# Altium project WarShip_ExtraBoard.PrjPcb
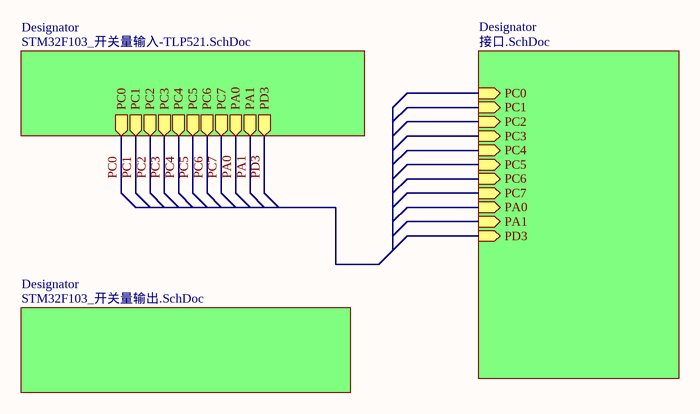
[diagram p0: STM32F103_扩展板.SchDoc]
4 sheets, 142 parts. Net scope: global (net labels, ports and power ports of the same name join across sheets).
Board file: STM32F103_扩展板.PcbDoc
Sheets:
  STM32F103_扩展板.SchDoc
    Designator = STM32F103_开关量输入-TLP521.SchDoc
    Designator = STM32F103_开关量输出.SchDoc
    Designator = 接口.SchDoc

## Sheet STM32F103_扩展板.SchDoc
size A4; SheetNumber: 1; SheetTotal: 4

### Sub-sheets
Designator = STM32F103_开关量输入-TLP521.SchDoc: PC0 (out), PC1 (out), PC2 (out), PC3 (out), PC4 (out), PC5 (out), PC6 (out), PC7 (out), PA0 (out), PA1 (out), PD3 (out)
Designator = STM32F103_开关量输出.SchDoc: no entries
Designator = 接口.SchDoc: PC0 (in), PC1 (in), PC2 (in), PC3 (in), PC4 (in), PC5 (in), PC6 (in), PC7 (in), PA0 (in), PA1 (in), PD3 (in)

## Sheet STM32F103_开关量输入-TLP521.SchDoc
size A4; SheetNumber: 4; SheetTotal: 4
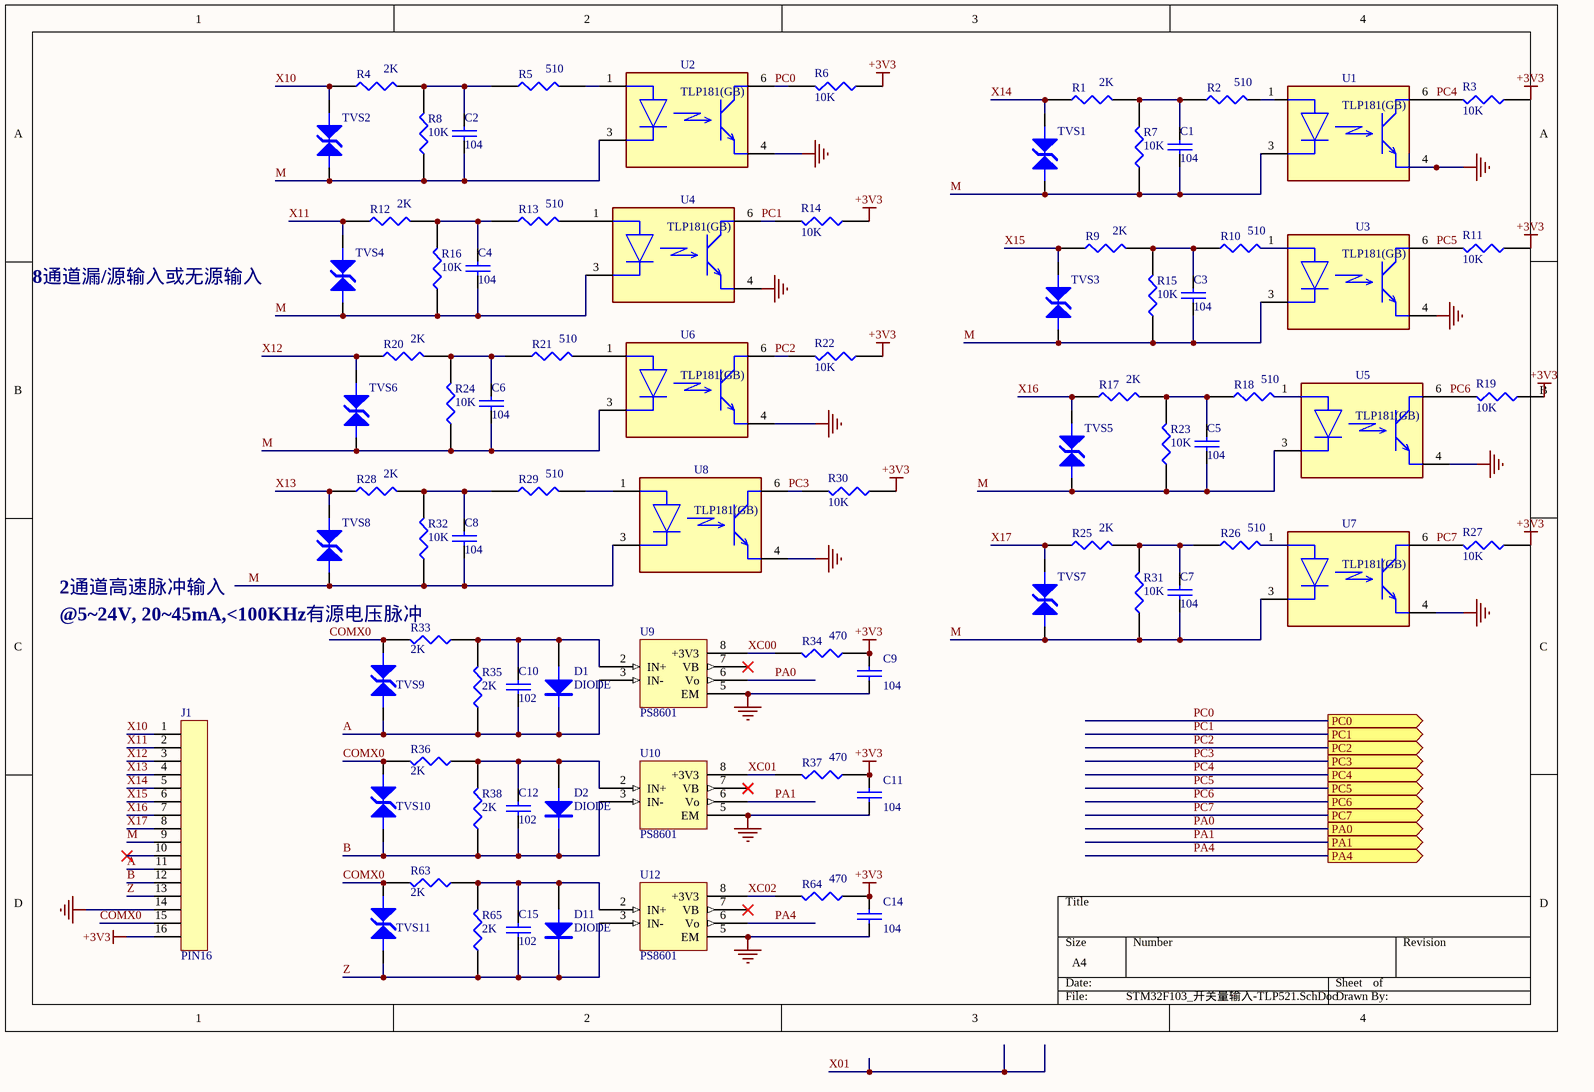
[diagram p1: STM32F103_开关量输入-TLP521.SchDoc]

### Parts
C1  104  [CAP[0603]]
C2  104  [CAP[0603]]
C3  104  [CAP[0603]]
C4  104  [CAP[0603]]
C5  104  [CAP[0603]]
C6  104  [CAP[0603]]
C7  104  [CAP[0603]]
C8  104  [CAP[0603]]
C9  104  [CAP[0603]]
C10  102  [CAP[0603]]
C11  104  [CAP[0603]]
C12  102  [CAP[0603]]
C14  104  [CAP[0603]]
C15  102  [CAP[0603]]
D1  DIODE  [SOD-123]
D2  DIODE  [SOD-123]
D11  DIODE  [SOD-123]
J1  PIN16  [KF128-5.08-16P]
R1  2K  [RES[0603]]
R2  510  [RES[0603]]
R3  10K  [RES[0603]]
R4  2K  [RES[0603]]
R5  510  [RES[0603]]
R6  10K  [RES[0603]]
R7  10K  [RES[0603]]
R8  10K  [RES[0603]]
R9  2K  [RES[0603]]
R10  510  [RES[0603]]
R11  10K  [RES[0603]]
R12  2K  [RES[0603]]
R13  510  [RES[0603]]
R14  10K  [RES[0603]]
R15  10K  [RES[0603]]
R16  10K  [RES[0603]]
R17  2K  [RES[0603]]
R18  510  [RES[0603]]
R19  10K  [RES[0603]]
R20  2K  [RES[0603]]
R21  510  [RES[0603]]
R22  10K  [RES[0603]]
R23  10K  [RES[0603]]
R24  10K  [RES[0603]]
R25  2K  [RES[0603]]
R26  510  [RES[0603]]
R27  10K  [RES[0603]]
R28  2K  [RES[0603]]
R29  510  [RES[0603]]
R30  10K  [RES[0603]]
R31  10K  [RES[0603]]
R32  10K  [RES[0603]]
R33  2K  [RES[0603]]
R34  470  [RES[0603]]
R35  2K  [RES[0603]]
R36  2K  [RES[0603]]
R37  470  [RES[0603]]
R38  2K  [RES[0603]]
R63  2K  [RES[0603]]
R64  470  [RES[0603]]
R65  2K  [RES[0603]]
TVS1  (no value)  [TVS]
TVS2  (no value)  [TVS]
TVS3  (no value)  [TVS]
TVS4  (no value)  [TVS]
TVS5  (no value)  [TVS]
TVS6  (no value)  [TVS]
TVS7  (no value)  [TVS]
TVS8  (no value)  [TVS]
TVS9  (no value)  [TVS]
TVS10  (no value)  [TVS]
TVS11  (no value)  [TVS]
U1  TLP181(GB)  [FP-11-4C1-MFG]
U2  TLP181(GB)  [FP-11-4C1-MFG]
U3  TLP181(GB)  [FP-11-4C1-MFG]
U4  TLP181(GB)  [FP-11-4C1-MFG]
U5  TLP181(GB)  [FP-11-4C1-MFG]
U6  TLP181(GB)  [FP-11-4C1-MFG]
U7  TLP181(GB)  [FP-11-4C1-MFG]
U8  TLP181(GB)  [FP-11-4C1-MFG]
U9  PS8601  [DIP8_8601]
U10  PS8601  [DIP8_8601]
U12  PS8601  [DIP8_8601]

### Ports
PA0 (out), PA1 (out), PA4 (out), PC0 (out), PC1 (out), PC2 (out), PC3 (out), PC4 (out), PC5 (out), PC6 (out), PC7 (out)

### Nets
+3V3: C9.1 C11.1 C14.1 J1.16 R3.1 R6.1 R11.1 R14.1 R19.1 R22.1 R27.1 R30.1 R34.1 R37.1 R64.1
GND: C9.2 C11.2 C14.2 J1.14 U1.4(E) U2.4(E) U3.4(E) U4.4(E) U5.4(E) U6.4(E) U7.4(E) U8.4(E) U9.5(EM) U10.5(EM) U12.5(EM)
NC: U9.1(NC) U9.4(NC) U10.1(NC) U10.4(NC) U12.1(NC) U12.4(NC)
A: C10.2 D1.2(K) J1.11 R35.1 TVS9.1(A) U9.3(IN-)
B: C12.2 D2.2(K) J1.12 R38.1 TVS10.1(A) U10.3(IN-)
COMX0: J1.15 R33.2 R36.2 R63.2 TVS9.2(K) TVS10.2(K) TVS11.2(K)
M: C1.2 C2.2 C3.2 C4.2 C5.2 C6.2 C7.2 C8.2 J1.9 R7.1 R8.1 R15.1 R16.1 R23.1 R24.1 R31.1 R32.1 TVS1.1(A) TVS2.1(A) TVS3.1(A) TVS4.1(A) TVS5.1(A) TVS6.1(A) TVS7.1(A) TVS8.1(A) U1.3(C) U2.3(C) U3.3(C) U4.3(C) U5.3(C) U6.3(C) U7.3(C) U8.3(C)
PA0: U9.6(Vo) ; port PA0
PA1: U10.6(Vo) ; port PA1
PA4: U12.6(Vo) ; port PA4
PC0: R6.2 U2.6(C) ; port PC0
PC1: R14.2 U4.6(C) ; port PC1
PC2: R22.2 U6.6(C) ; port PC2
PC3: R30.2 U8.6(C) ; port PC3
PC4: R3.2 U1.6(C) ; port PC4
PC5: R11.2 U3.6(C) ; port PC5
PC6: R19.2 U5.6(C) ; port PC6
PC7: R27.2 U7.6(C) ; port PC7
X10: J1.1 R4.1 TVS2.2(K)
X11: J1.2 R12.1 TVS4.2(K)
X12: J1.3 R20.1 TVS6.2(K)
X13: J1.4 R28.1 TVS8.2(K)
X14: J1.5 R1.1 TVS1.2(K)
X15: J1.6 R9.1 TVS3.2(K)
X16: J1.7 R17.1 TVS5.2(K)
X17: J1.8 R25.1 TVS7.2(K)
XC00: R34.2 U9.8(+3V3)
XC01: R37.2 U10.8(+3V3)
XC02: R64.2 U12.8(+3V3)
Z: C15.2 D11.2(K) J1.13 R65.1 TVS11.1(A) U12.3(IN-)
NetC1_1: C1.1 R1.2 R2.1 R7.2
NetC2_1: C2.1 R4.2 R5.1 R8.2
NetC3_1: C3.1 R9.2 R10.1 R15.2
NetC4_1: C4.1 R12.2 R13.1 R16.2
NetC5_1: C5.1 R17.2 R18.1 R23.2
NetC6_1: C6.1 R20.2 R21.1 R24.2
NetC7_1: C7.1 R25.2 R26.1 R31.2
NetC8_1: C8.1 R28.2 R29.1 R32.2
NetC10_1: C10.1 D1.1(A) R33.1 R35.2 U9.2(IN+)
NetC12_1: C12.1 D2.1(A) R36.1 R38.2 U10.2(IN+)
NetC15_1: C15.1 D11.1(A) R63.1 R65.2 U12.2(IN+)
NetR2_2: R2.2 U1.1(A)
NetR5_2: R5.2 U2.1(A)
NetR10_2: R10.2 U3.1(A)
NetR13_2: R13.2 U4.1(A)
NetR18_2: R18.2 U5.1(A)
NetR21_2: R21.2 U6.1(A)
NetR26_2: R26.2 U7.1(A)
NetR29_2: R29.2 U8.1(A)

Not connected (* = marked no-connect by the designer): J1 10*; U9 7(VB)*; U10 7(VB)*; U12 7(VB)*

### Notes on the sheet
- 8通道漏/源输入或无源输入
- 2通道高速脉冲输入
- @5~24V, 20~45mA,<100KHz有源电压脉冲

### Library data of the parts
C1-C12 C14 C15 = CAP: Capacitor
R1-R38 R63-R65 = RES1
TVS1-TVS11 = TVS
U1-U8 = CMP-35887-000008-1: OPTOCOUPLER TRANS 3.75KVRMS 6SO; Manufacturer: Toshiba; Collector Emitter Voltage: 80V; Min Current Transfer Ratio: 100%; Max Junction Temp: +125°C; Power Dissipation: 200mW; Max Current Transfer Ratio: 600%; Max Supply Voltage: 48V; Forward Voltage: 1.15V; Turn On Delay Time: 3us; Isolation Voltage: 3750Vrms; Reverse Voltage: 5V; Forward Current: 10mA; Emiiter Collector Voltage: 7V; Standoff Height: 0.1mm; Footprint Url: https://toshiba.semicon-storage.com/eu/design-support/package/detail.4pin%20MFSOP6.html; Device Class L3: unset; ComponentLink2Description: Datasheet; Device Class L1: Optoelectronics; Temperature: -55°C to +110°C; Temperature Range High: +110°C; Automotive: No; Octopart: https://octopart.com/tlp181gb-toshiba-8180795; ComponentLink2URL: https://toshiba.semicon-storage.com/info/docget.jsp?did=16749&prodName=TLP181; Category: Trans; Package: 11-4C1; Turn Off Delay Time: 3us; Temperature Range Low: -55°C; Device Class L2: Optocouplers; RoHS: TRUE; Lead Free: Yes; Ipc Land Pattern Name: SOP254P700X260-4; Manufacturer Part Number: TLP181(GB); Height: 2.8mm
U9 U10 U12 = PS8601: High speed optocoupler

## Sheet STM32F103_开关量输出.SchDoc
size A2; SheetNumber: 2; SheetTotal: 4
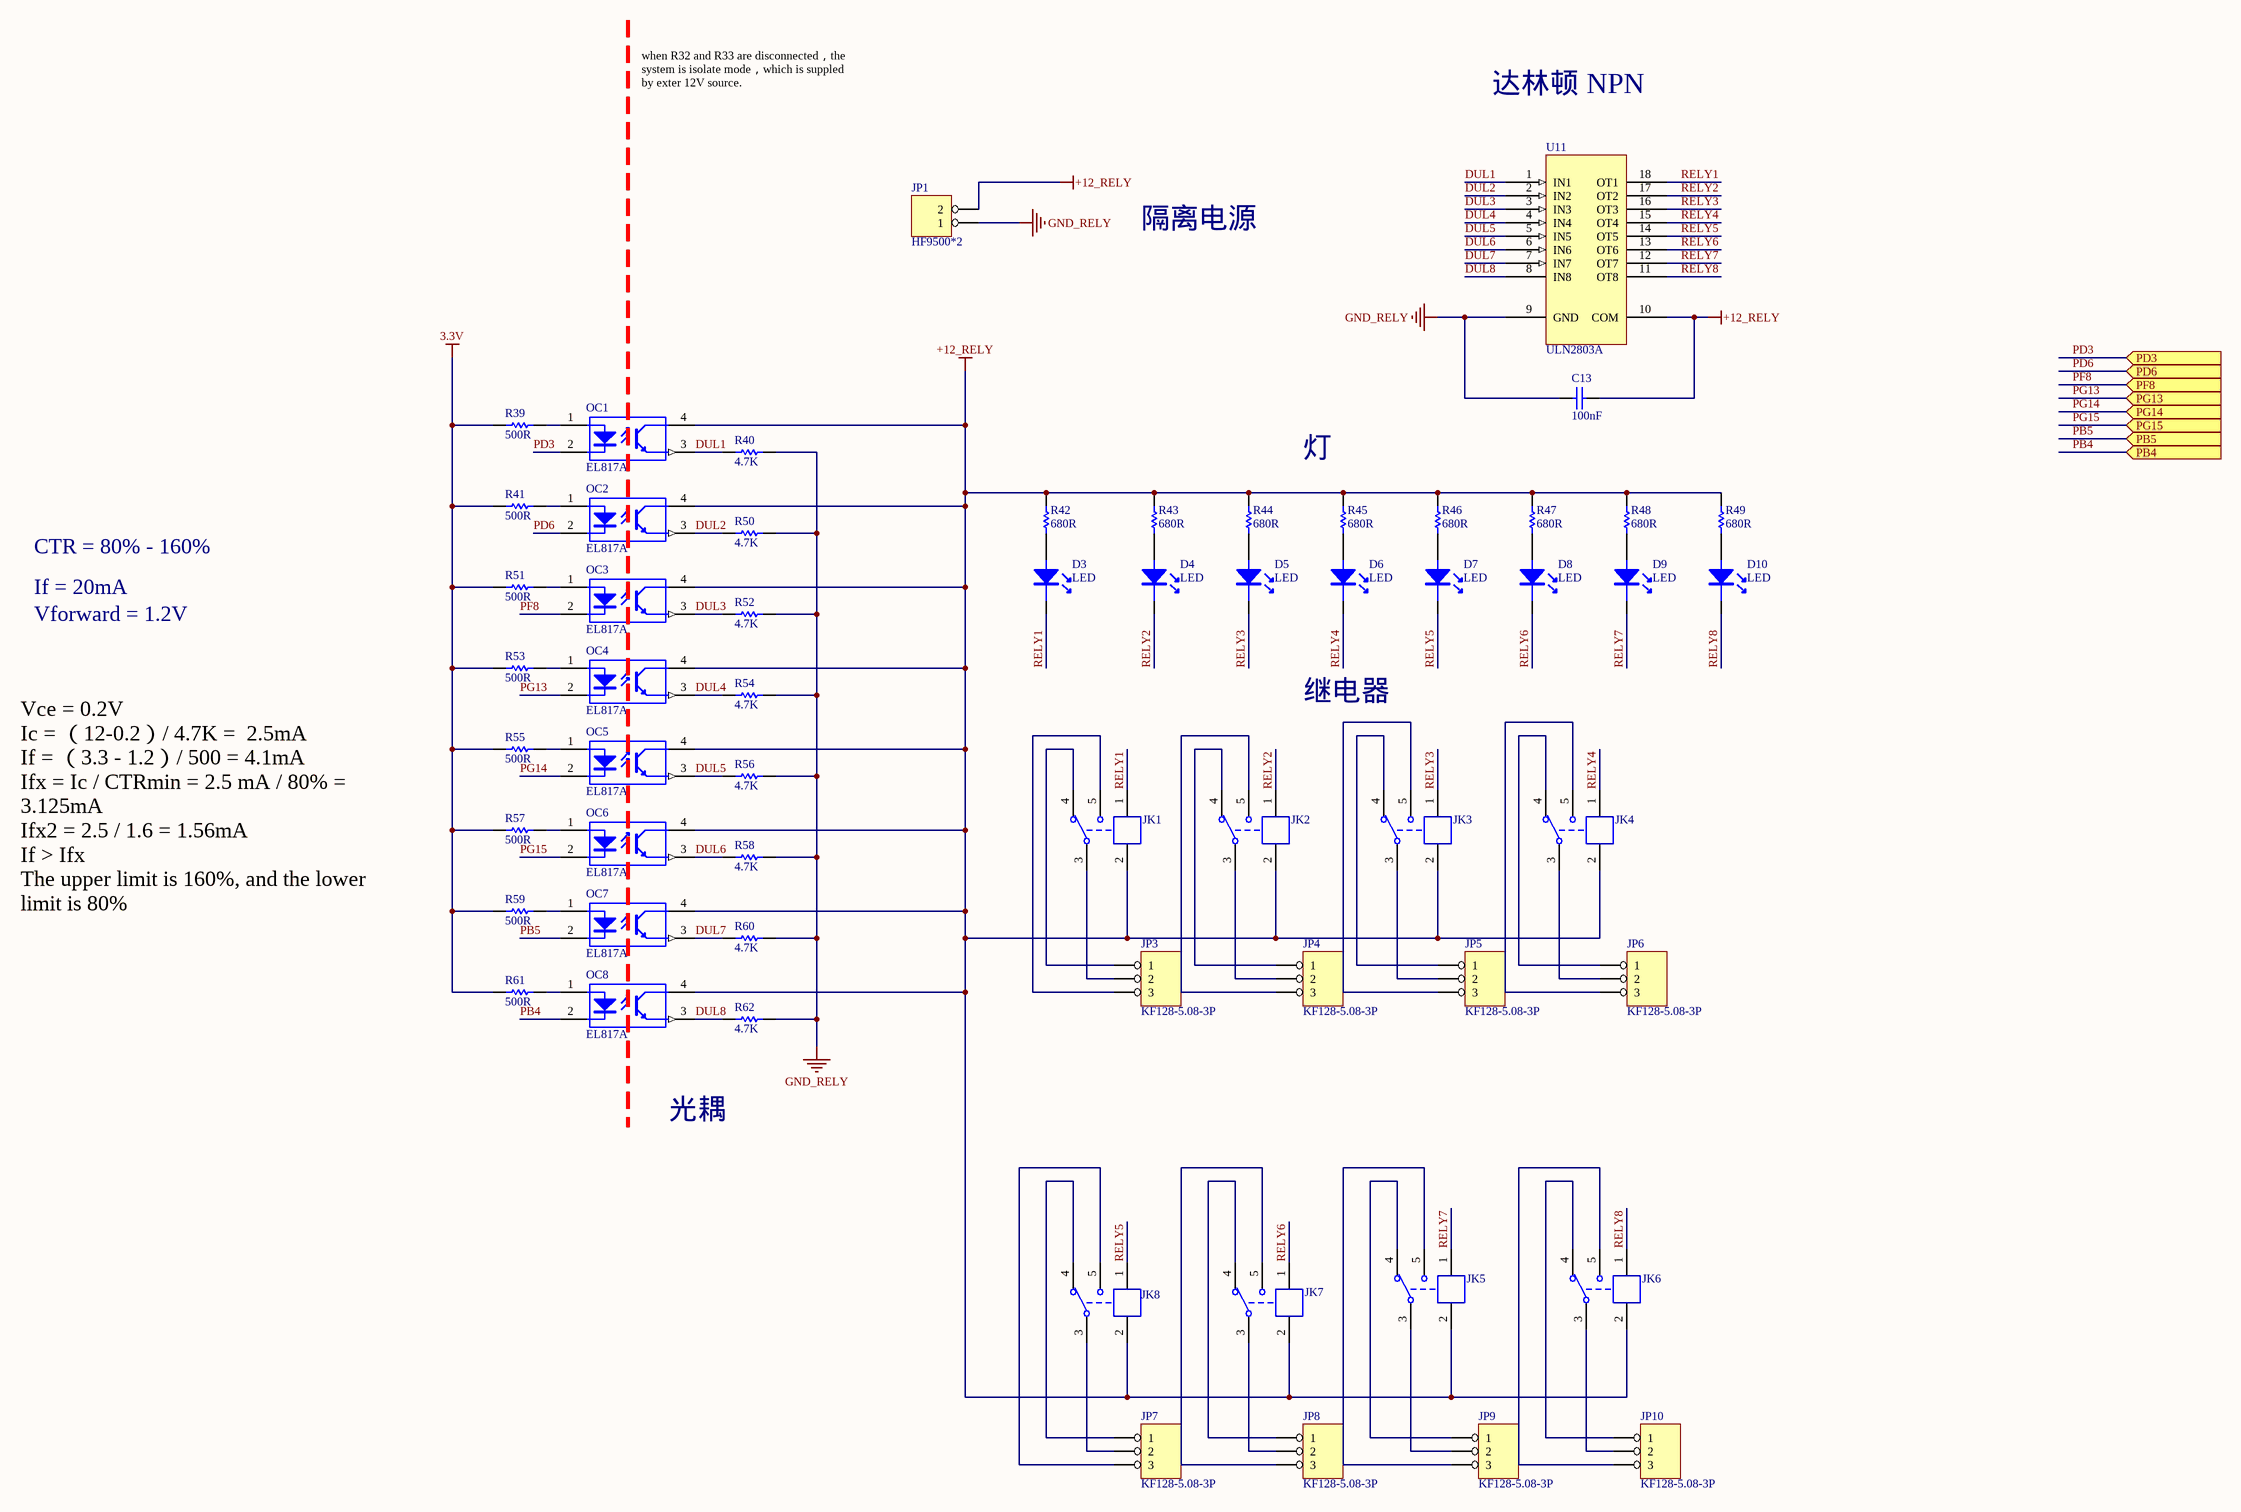
[diagram p2: STM32F103_开关量输出.SchDoc]

### Parts
C13  100nF  [0603C]
D3  LED  [LED-0603G]
D4  LED  [LED-0603G]
D5  LED  [LED-0603G]
D6  LED  [LED-0603G]
D7  LED  [LED-0603G]
D8  LED  [LED-0603G]
D9  LED  [LED-0603G]
D10  LED  [LED-0603G]
JK1  SRD-05VDC-SL-C  [SRD-C_B]  (value not drawn)
JK2  SRD-05VDC-SL-C  [SRD-C_B]  (value not drawn)
JK3  SRD-05VDC-SL-C  [SRD-C_B]  (value not drawn)
JK4  SRD-05VDC-SL-C  [SRD-C_B]  (value not drawn)
JK5  SRD-05VDC-SL-C  [SRD-C_B]  (value not drawn)
JK6  SRD-05VDC-SL-C  [SRD-C_B]  (value not drawn)
JK7  SRD-05VDC-SL-C  [SRD-C_B]  (value not drawn)
JK8  SRD-05VDC-SL-C  [SRD-C_B]  (value not drawn)
JP1  HF9500*2  [KF128-5.08-2P]
JP3  KF128-5.08-3P  [KF128-5.08-3P]
JP4  KF128-5.08-3P  [KF128-5.08-3P]
JP5  KF128-5.08-3P  [KF128-5.08-3P]
JP6  KF128-5.08-3P  [KF128-5.08-3P]
JP7  KF128-5.08-3P  [KF128-5.08-3P]
JP8  KF128-5.08-3P  [KF128-5.08-3P]
JP9  KF128-5.08-3P  [KF128-5.08-3P]
JP10  KF128-5.08-3P  [KF128-5.08-3P]
OC1  EL817A  [SMD_PC817]
OC2  EL817A  [SMD_PC817]
OC3  EL817A  [SMD_PC817]
OC4  EL817A  [SMD_PC817]
OC5  EL817A  [SMD_PC817]
OC6  EL817A  [SMD_PC817]
OC7  EL817A  [SMD_PC817]
OC8  EL817A  [SMD_PC817]
R39  500R  [0805R]
R40  4.7K  [0603R]
R41  500R  [0805R]
R42  680R  [0805R]
R43  680R  [0805R]
R44  680R  [0805R]
R45  680R  [0805R]
R46  680R  [0805R]
R47  680R  [0805R]
R48  680R  [0805R]
R49  680R  [0805R]
R50  4.7K  [0603R]
R51  500R  [0805R]
R52  4.7K  [0603R]
R53  500R  [0805R]
R54  4.7K  [0603R]
R55  500R  [0805R]
R56  4.7K  [0603R]
R57  500R  [0805R]
R58  4.7K  [0603R]
R59  500R  [0805R]
R60  4.7K  [0603R]
R61  500R  [0805R]
R62  4.7K  [0603R]
U11  ULN2803A  [SOP18 - 300mil]

### Ports
PB4 (in), PB5 (in), PD3 (in), PD6 (in), PF8 (in), PG13 (in), PG14 (in), PG15 (in)

### Nets
3.3V: R39.2 R41.2 R51.2 R53.2 R55.2 R57.2 R59.2 R61.2
+12_RELY: C13.2 JK1.2 JK2.2 JK3.2 JK4.2 JK5.2 JK6.2 JK7.2 JK8.2 JP1.2 OC1.4(C) OC2.4(C) OC3.4(C) OC4.4(C) OC5.4(C) OC6.4(C) OC7.4(C) OC8.4(C) R42.1 R43.1 R44.1 R45.1 R46.1 R47.1 R48.1 R49.1 U11.10(COM)
GND_RELY: C13.1 JP1.1 R40.2 R50.2 R52.2 R54.2 R56.2 R58.2 R60.2 R62.2 U11.9(GND)
DUL1: OC1.3(E) R40.1 U11.1(IN1)
DUL2: OC2.3(E) R50.1 U11.2(IN2)
DUL3: OC3.3(E) R52.1 U11.3(IN3)
DUL4: OC4.3(E) R54.1 U11.4(IN4)
DUL5: OC5.3(E) R56.1 U11.5(IN5)
DUL6: OC6.3(E) R58.1 U11.6(IN6)
DUL7: OC7.3(E) R60.1 U11.7(IN7)
DUL8: OC8.3(E) R62.1 U11.8(IN8)
PB4: OC8.2(K) ; port PB4
PB5: OC7.2(K) ; port PB5
PD3: OC1.2(K) ; port PD3
PD6: OC2.2(K) ; port PD6
PF8: OC3.2(K) ; port PF8
PG13: OC4.2(K) ; port PG13
PG14: OC5.2(K) ; port PG14
PG15: OC6.2(K) ; port PG15
RELY1: D3.2(K) JK1.1 U11.18(OT1)
RELY2: D4.2(K) JK2.1 U11.17(OT2)
RELY3: D5.2(K) JK3.1 U11.16(OT3)
RELY4: D6.2(K) JK4.1 U11.15(OT4)
RELY5: D7.2(K) JK8.1 U11.14(OT5)
RELY6: D8.2(K) JK7.1 U11.13(OT6)
RELY7: D9.2(K) JK5.1 U11.12(OT7)
RELY8: D10.2(K) JK6.1 U11.11(OT8)
NetD3_1: D3.1(A) R42.2
NetD4_1: D4.1(A) R43.2
NetD5_1: D5.1(A) R44.2
NetD6_1: D6.1(A) R45.2
NetD7_1: D7.1(A) R46.2
NetD8_1: D8.1(A) R47.2
NetD9_1: D9.1(A) R48.2
NetD10_1: D10.1(A) R49.2
NetJK1_3: JK1.3 JP3.2
NetJK1_4: JK1.4 JP3.1
NetJK1_5: JK1.5 JP3.3
NetJK2_3: JK2.3 JP4.2
NetJK2_4: JK2.4 JP4.1
NetJK2_5: JK2.5 JP4.3
NetJK3_3: JK3.3 JP5.2
NetJK3_4: JK3.4 JP5.1
NetJK3_5: JK3.5 JP5.3
NetJK4_3: JK4.3 JP6.2
NetJK4_4: JK4.4 JP6.1
NetJK4_5: JK4.5 JP6.3
NetJK5_3: JK5.3 JP9.2
NetJK5_4: JK5.4 JP9.1
NetJK5_5: JK5.5 JP9.3
NetJK6_3: JK6.3 JP10.2
NetJK6_4: JK6.4 JP10.1
NetJK6_5: JK6.5 JP10.3
NetJK7_3: JK7.3 JP8.2
NetJK7_4: JK7.4 JP8.1
NetJK7_5: JK7.5 JP8.3
NetJK8_3: JK8.3 JP7.2
NetJK8_4: JK8.4 JP7.1
NetJK8_5: JK8.5 JP7.3
NetOC1_1: OC1.1(A) R39.1
NetOC2_1: OC2.1(A) R41.1
NetOC3_1: OC3.1(A) R51.1
NetOC4_1: OC4.1(A) R53.1
NetOC5_1: OC5.1(A) R55.1
NetOC6_1: OC6.1(A) R57.1
NetOC7_1: OC7.1(A) R59.1
NetOC8_1: OC8.1(A) R61.1

### Notes on the sheet
- when R32 and R33 are disconnected，the system is isolate mode，which is suppled by exter 12V source.
- 达林顿 NPN
- 隔离电源
- 灯
- CTR = 80% - 160%
- If = 20mA
- Vforward = 1.2V
- 继电器
- Vce = 0.2V
  Ic = （12-0.2）/ 4.7K =  2.5mA
  If = （3.3 - 1.2）/ 500 = 4.1mA
  Ifx = Ic / CTRmin = 2.5 mA / 80% = 3.125mA
  Ifx2 = 2.5 / 1.6 = 1.56mA
  If > Ifx
  The upper limit is 160%, and the lower limit is 80%
- 光耦

### Library data of the parts
C13 = CAP: Capacitor; Value: 104; Published: 8-Jun-2000; LatestRevisionDate: 17-Jul-2002; LatestRevisionNote: Re-released for DXP Platform.; PackageReference: RAD-0.3; Publisher: Altium Limited
D3-D10 = LED: LED 发光二极管
JK1-JK8 = SRD-05VDC-SL-C: 5V一组转换
JP1 = HEADER 2
JP3-JP10 = HEADER 3
OC1-OC8 = EL357N: 线性光耦
R39-R62 = RES: Resistor; Value: 1K; Published: 8-Jun-2000; Revision: July-2002: Re-released for DXP Platform.; Publisher: Altium Limited
U11 = ULN2803A: 8 channels Darlington

## Sheet 接口.SchDoc
size A4; SheetNumber: 3; SheetTotal: 4
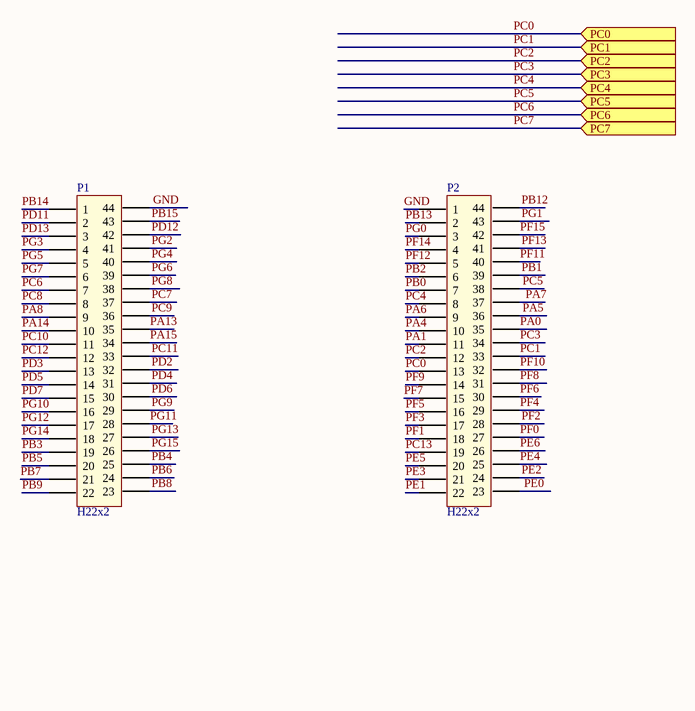
[diagram p3: 接口.SchDoc]

### Parts
P1  H22x2  [HDR2.54-F-44P]
P2  H22x2  [HDR2.54-F-44P]

### Ports
PC0 (in), PC1 (in), PC2 (in), PC3 (in), PC4 (in), PC5 (in), PC6 (in), PC7 (in)

### Nets
GND: P1.44 P2.1
PA0: P2.35
PA1: P2.11
PA4: P2.10
PA5: P2.36
PA6: P2.9
PA7: P2.37
PA8: P1.9
PA13: P1.35
PA14: P1.10
PA15: P1.34
PB0: P2.7
PB1: P2.39
PB2: P2.6
PB3: P1.19
PB4: P1.25
PB5: P1.20
PB6: P1.24
PB7: P1.21
PB8: P1.23
PB9: P1.22
PB12: P2.44
PB13: P2.2
PB14: P1.1
PB15: P1.43
PC0: P2.13 ; port PC0
PC1: P2.33 ; port PC1
PC2: P2.12 ; port PC2
PC3: P2.34 ; port PC3
PC4: P2.8 ; port PC4
PC5: P2.38 ; port PC5
PC6: P1.7 ; port PC6
PC7: P1.37 ; port PC7
PC8: P1.8
PC9: P1.36
PC10: P1.11
PC11: P1.33
PC12: P1.12
PC13: P2.19
PD2: P1.32
PD3: P1.13
PD4: P1.31
PD5: P1.14
PD6: P1.30
PD7: P1.15
PD11: P1.2
PD12: P1.42
PD13: P1.3
PE0: P2.23
PE1: P2.22
PE2: P2.24
PE3: P2.21
PE4: P2.25
PE5: P2.20
PE6: P2.26
PF0: P2.27
PF1: P2.18
PF2: P2.28
PF3: P2.17
PF4: P2.29
PF5: P2.16
PF6: P2.30
PF7: P2.15
PF8: P2.31
PF9: P2.14
PF10: P2.32
PF11: P2.40
PF12: P2.5
PF13: P2.41
PF14: P2.4
PF15: P2.42
PG0: P2.3
PG1: P2.43
PG2: P1.41
PG3: P1.4
PG4: P1.40
PG5: P1.5
PG6: P1.39
PG7: P1.6
PG8: P1.38
PG9: P1.29
PG10: P1.16
PG11: P1.28
PG12: P1.17
PG13: P1.27
PG14: P1.18
PG15: P1.26

### Notes on the sheet
- Text

## Nets that join several sheets
GND: STM32F103_开关量输入-TLP521 (15 pins), 接口 (P1.44 P2.1)
PA0: STM32F103_开关量输入-TLP521 (U9.6), 接口 (P2.35)
PA1: STM32F103_开关量输入-TLP521 (U10.6), 接口 (P2.11)
PA4: STM32F103_开关量输入-TLP521 (U12.6), 接口 (P2.10)
PB4: STM32F103_开关量输出 (OC8.2), 接口 (P1.25)
PB5: STM32F103_开关量输出 (OC7.2), 接口 (P1.20)
PC0: STM32F103_开关量输入-TLP521 (R6.2 U2.6), 接口 (P2.13)
PC1: STM32F103_开关量输入-TLP521 (R14.2 U4.6), 接口 (P2.33)
PC2: STM32F103_开关量输入-TLP521 (R22.2 U6.6), 接口 (P2.12)
PC3: STM32F103_开关量输入-TLP521 (R30.2 U8.6), 接口 (P2.34)
PC4: STM32F103_开关量输入-TLP521 (R3.2 U1.6), 接口 (P2.8)
PC5: STM32F103_开关量输入-TLP521 (R11.2 U3.6), 接口 (P2.38)
PC6: STM32F103_开关量输入-TLP521 (R19.2 U5.6), 接口 (P1.7)
PC7: STM32F103_开关量输入-TLP521 (R27.2 U7.6), 接口 (P1.37)
PD3: STM32F103_开关量输出 (OC1.2), 接口 (P1.13)
PD6: STM32F103_开关量输出 (OC2.2), 接口 (P1.30)
PF8: STM32F103_开关量输出 (OC3.2), 接口 (P2.31)
PG13: STM32F103_开关量输出 (OC4.2), 接口 (P1.27)
PG14: STM32F103_开关量输出 (OC5.2), 接口 (P1.18)
PG15: STM32F103_开关量输出 (OC6.2), 接口 (P1.26)